# EAGLE design Arduino-Pro-Mini-v11 (EAGLE 6.0)
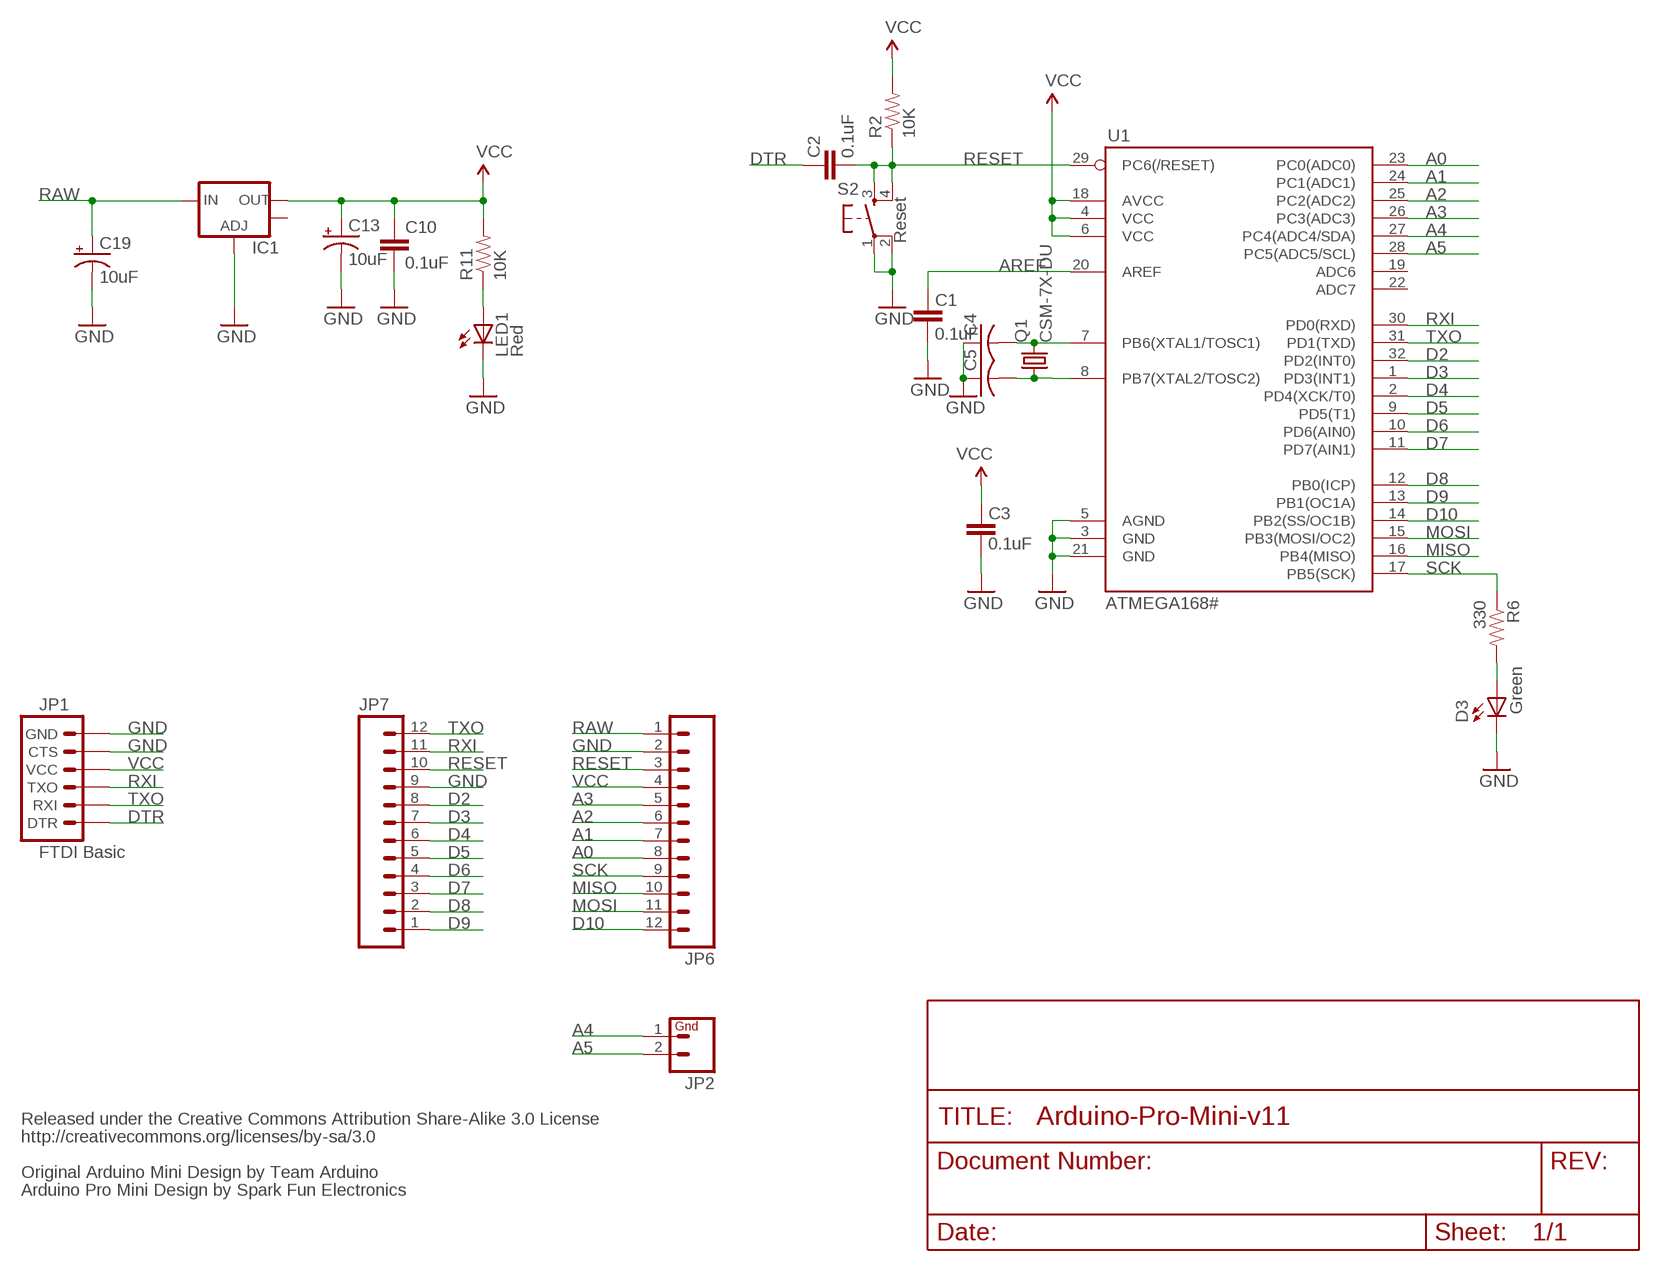
[diagram p0: schematic, sheet 1]

## Parts
C1  0.1uF  CAP0805  [0805]
C2  0.1uF  CAP0805  [0805]
C3  0.1uF  CAP0805  [0805]
C4  C-USC0805  [C0805]
C5  C-USC0805  [C0805]
C10  0.1uF  CAP0805  [0805]
C13  10uF  CAP_POL1206  [EIA3216]
C19  10uF  CAP_POL1206  [EIA3216]
D3  Green  LED0603  [LED-0603]
IC1  V_REG_LM1117SOT223  [SOT223]
JP1  FTDI Basic  ARDUINO_SERIAL_PROGRAMPTH  [1X06]
JP2  M02PTH  [1X02]
JP6  M12PTH  [1X12]
JP7  M12PTH  [1X12]
LED1  Red  LED0603  [LED-0603]
Q1  CSM-7X-DU  [CSM-7X-DU]
R2  10K  RESISTOR  [0805]
R6  330  RESISTOR  [0805]
R11  10K  RESISTOR  [0805]
S2  Reset  TAC_SWITCHSND  [TACTILE_SWITCH_SMD]
U1  ATMEGA168#  ATMEGA168  [TQFP32-08]

## Nets
A0: JP6.8 U1.23(PC0(ADC0))
A1: JP6.7 U1.24(PC1(ADC1))
A2: JP6.6 U1.25(PC2(ADC2))
A3: JP6.5 U1.26(PC3(ADC3))
A4: JP2.1 U1.27(PC4(ADC4/SDA))
A5: JP2.2 U1.28(PC5(ADC5/SCL))
AREF: C1.2 U1.20(AREF)
D2: JP7.8 U1.32(PD2(INT0))
D3: JP7.7 U1.1(PD3(INT1))
D4: JP7.6 U1.2(PD4(XCK/T0))
D5: JP7.5 U1.9(PD5(T1))
D6: JP7.4 U1.10(PD6(AIN0))
D7: JP7.3 U1.11(PD7(AIN1))
D8: JP7.2 U1.12(PB0(ICP))
D9: JP7.1 U1.13(PB1(OC1A))
D10: JP6.12 U1.14(PB2(SS/OC1B))
DTR: C2.2 JP1.1(DTR)
GND: C1.1 C3.1 C4.1 C5.1 C10.2 C13.C(-) C19.C(-) D3.C IC1.1(ADJ) JP1.5(CTS) JP1.6(GND) JP6.2 JP7.9 LED1.C S2.1 S2.2 U1.3(GND) U1.5(AGND) U1.21(GND)
MISO: JP6.10 U1.16(PB4(MISO))
MOSI: JP6.11 U1.15(PB3(MOSI/OC2))
N$1: C5.2 Q1.1 U1.8(PB7(XTAL2/TOSC2))
N$3: C4.2 Q1.2 U1.7(PB6(XTAL1/TOSC1))
N$7: D3.A R6.2
N$38: LED1.A R11.1
RAW [vcc]: C19.A(+) IC1.3(IN) JP6.1
RESET: C2.1 JP6.3 JP7.10 R2.1 S2.3 S2.4 U1.29(PC6(/RESET))
RXI: JP1.3(TXO) JP7.11 U1.30(PD0(RXD))
SCK: JP6.9 R6.1 U1.17(PB5(SCK))
TXO: JP1.2(RXI) JP7.12 U1.31(PD1(TXD))
VCC: C3.2 C10.1 C13.A(+) IC1.2(OUT) JP1.4(VCC) JP6.4 R2.2 R11.2 U1.4(VCC) U1.6(VCC) U1.18(AVCC)
Unconnected: IC1.4(OUT) U1.19(ADC6) U1.22(ADC7)

## Notes on the sheet
- Released under the Creative Commons Attribution Share-Alike 3.0 License
- http://creativecommons.org/licenses/by-sa/3.0
- Original Arduino Mini Design by Team Arduino
- Arduino Pro Mini Design by Spark Fun Electronics

## Library data of the parts
C1-C3 C10 = SparkFun:CAP: Capacitor Standard 0603 ceramic capacitor, and 0.1" leaded capacitor.
C4 C5 = rcl:C-US: CAPACITOR, American symbol
C13 C19 = SparkFun:CAP_POL: Capacitor Polarized These are standard SMD and PTH capacitors. Normally 10uF, 47uF, and 100uF in electrolytic and tantalum varieties. Always verify the external diameter of the through hole cap, it varies with capacity, voltage, and manufacturer. The EIA devices should be standard.
D3 LED1 = SparkFun:LED: LEDs Standard schematic elements and footprints for 5mm, 3mm, 1206, and 0603 sized LEDs. 5mm - Spark Fun Electronics SKU : COM-00529 (and others)
IC1 = SparkFun:V_REG_LM1117: Voltage Regulator LM1117 Standard adjustable voltage regulator but in SMD form. Spark Fun Electronics SKU : COM-00595
JP1 = SparkFun:ARDUINO_SERIAL_PROGRAM
JP2 = SparkFun:M02: Header 2 Standard 2-pin 0.1" header. Use with straight break away headers (SKU : PRT-00116), right angle break away headers (PRT-00553), swiss pins (PRT-00743), machine pins (PRT-00117), and female headers (PRT-00115). Molex polarized connector foot print use with SKU : PRT-08233 with associated crimp pins and housings.
JP6 JP7 = SparkFun:M12: Header 12 Standard 12-pin 0.1" header. Use with straight break away headers (SKU : PRT-00116), right angle break away headers (PRT-00553), swiss pins (PRT-00743), machine pins (PRT-00117), and female headers (PRT-00115).
Q1 = crystal:CSM-7X-DU: SMD CRYSTAL Source: www.ecsxtal.com .. Crystal 3.6864MHz CSM_7X_DU.PDF; OC_FARNELL: unknown; OC_NEWARK: unknown
R2 R6 R11 = SparkFun:RESISTOR: Resistor Basic schematic elements and footprints for 0603, 1206, and PTH 1/10th watt (small) resistors.
S2 = SparkFun:TAC_SWITCH: Momentary Switch Button commonly used for reset or general input. Spark Fun Electronics SKU : COM-00097
U1 = SparkFun:ATMEGA168

## Net classes
0 default: width 0.203 mm
1 vcc: width 0.254 mm

## Board
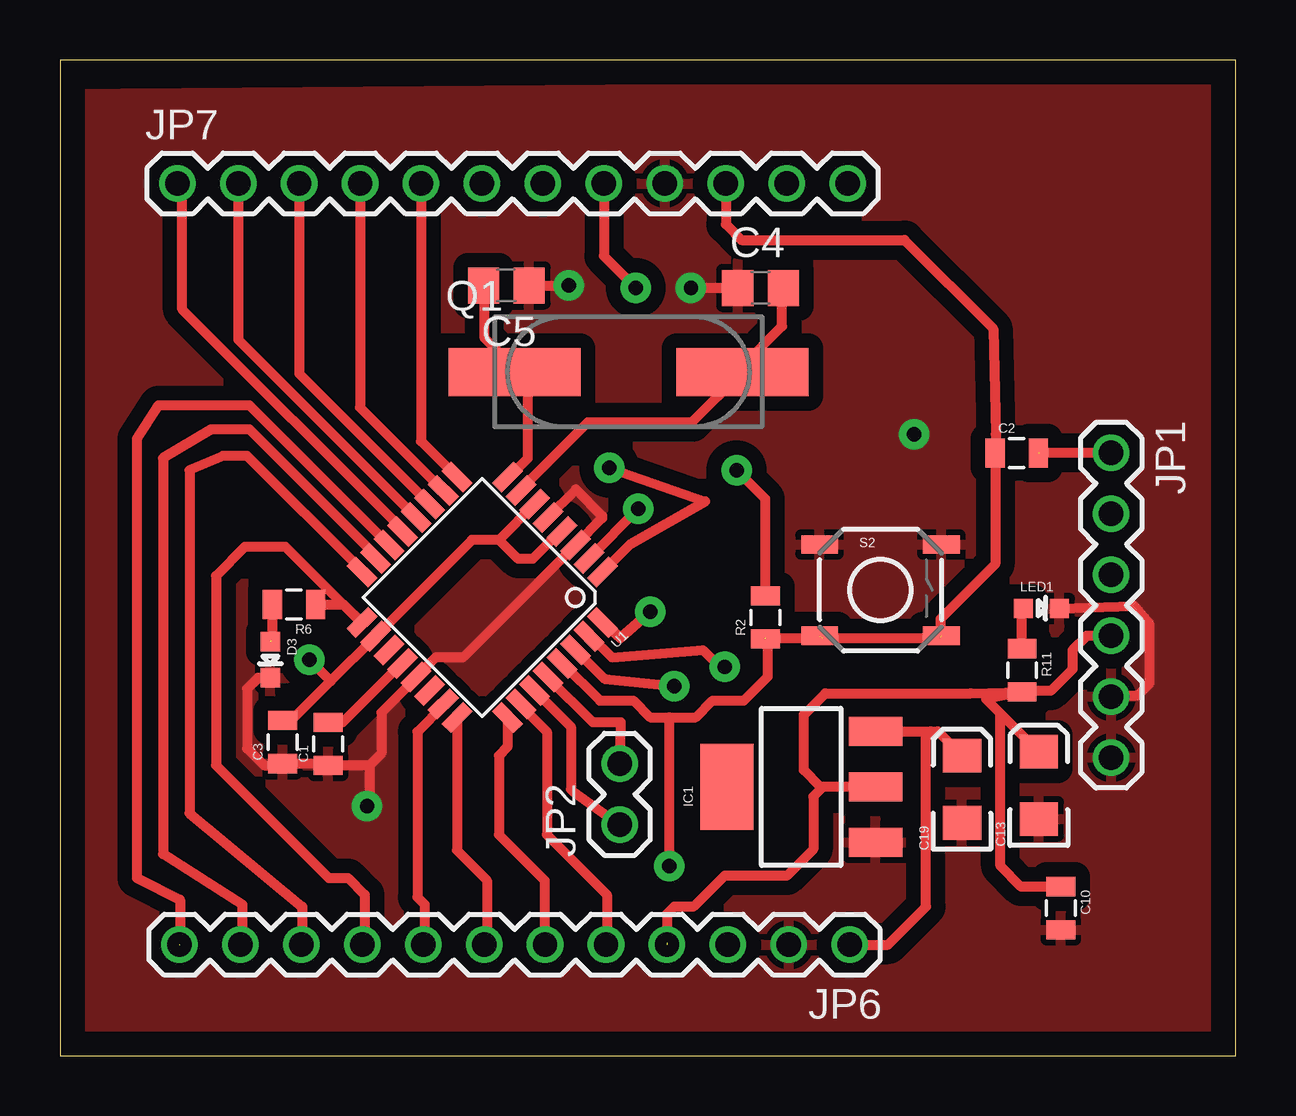
[diagram p1: board, top side]
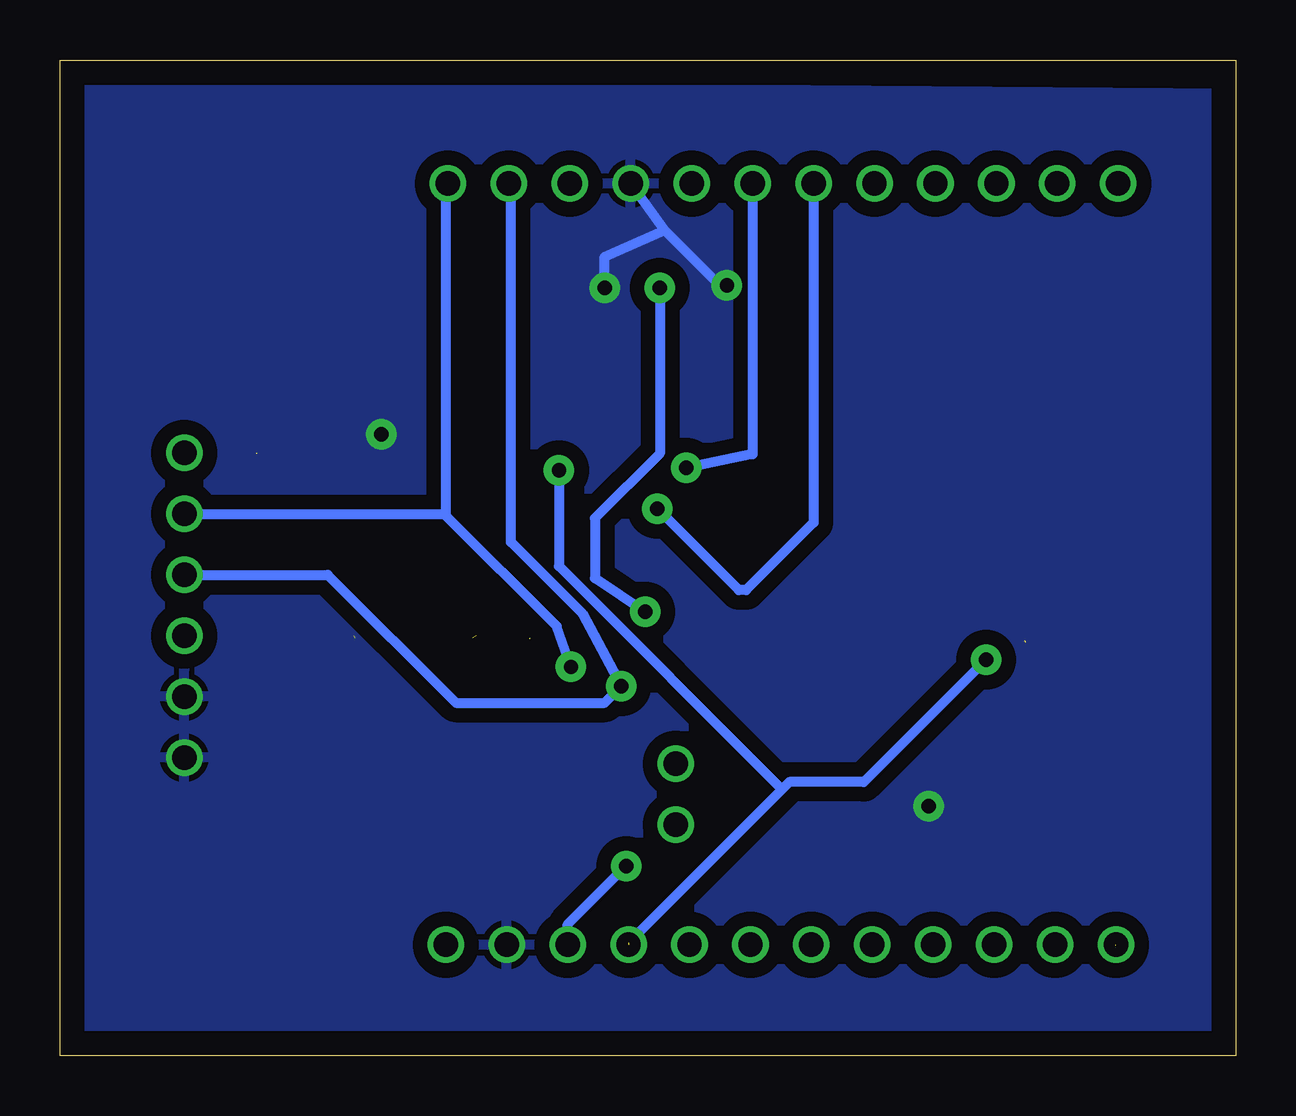
[diagram p2: board, bottom side, seen from below]

Size 49 x 41.5 mm. Coordinates in mm from the lower left corner, seen from the top.
Outline: 0,0 49,0 49,41.5 0,41.5 0,0
Copper layers (1*16): Top 0.035mm / dielectric 1.5mm / Bottom 0.035mm
Design rules: minimum track width 10mil, minimum drill 24mil, track to track 8mil, track to pad 8mil, pad to pad 8mil, via to via 8mil, smd to smd 8mil, copper to edge 40mil, drill to drill 8mil, minimum pad ring 10mil, minimum via ring 8mil, stop-mask expansion 4mil, vias tented up to drill 0mil, thermal gap 10mil

### Footprints (pad centres in the part's own frame; a part is rotated, then mirrored left to right if it is on the bottom)
0805 = smd 0.8 x 1.2: 1 -0.9,0; 2 0.9,0
C0805 = smd 1.3 x 1.5: 1 -0.95,0; 2 0.95,0
EIA3216 = smd 1.4 x 1.6: A 1.4,0; C -1.4,0
LED-0603 = smd 0.8 x 0.8: A 0,-0.75; C 0,0.75
SOT223 = smd 1.219 x 2.235: 1 -2.311,-3.099; 2 0,-3.099; 3 2.311,-3.099 | smd 3.6 x 2.2: 4 0,3.099
1X06 = drill 1.016: 1 0,0; 2 2.54,0; 3 5.08,0; 4 7.62,0; 5 10.16,0; 6 12.7,0
1X02 = drill 1.016: 1 0,0; 2 2.54,0
1X12 = drill 1.016: 1 0,0; 2 2.54,0; 3 5.08,0; 4 7.62,0; 5 10.16,0; 6 12.7,0; 7 15.24,0; 8 17.78,0; 9 20.32,0; 10 22.86,0; 11 25.4,0; 12 27.94,0
CSM-7X-DU = smd 5.5 x 2: 1 -4.75,0; 2 4.75,0
TACTILE_SWITCH_SMD = smd 1.524 x 0.762: 1 -2.54,1.905; 2 2.54,1.905; 3 -2.54,-1.905; 4 2.54,-1.905
TQFP32-08 = smd 1.27 x 0.559: 1 -4.293,2.8; 2 -4.293,2; 3 -4.293,1.2; 4 -4.293,0.4; 5 -4.293,-0.4; 6 -4.293,-1.2; 7 -4.293,-2; 8 -4.293,-2.8; 17 4.293,-2.8; 18 4.293,-2; 19 4.293,-1.2; 20 4.293,-0.4; 21 4.293,0.4; 22 4.293,1.2; 23 4.293,2; 24 4.293,2.8 | smd 0.559 x 1.27: 9 -2.8,-4.293; 10 -2,-4.293; 11 -1.2,-4.293; 12 -0.4,-4.293; 13 0.4,-4.293; 14 1.2,-4.293; 15 2,-4.293; 16 2.8,-4.293; 25 2.8,4.293; 26 2,4.293; 27 1.2,4.293; 28 0.4,4.293; 29 -0.4,4.293; 30 -1.2,4.293; 31 -2,4.293; 32 -2.8,4.293

### Placement (x,y rotation side)
C1  11.18,12.99 90 top
C2  39.88,25.12 0 top
C3  9.28,13.07 90 top
C4  29.2,32 0 top
C5  18.6,32.1 180 top
C10  41.72,6.14 270 top
C13  40.8,11.26 90 top
C19  37.6,11.1 90 top
D3  8.77,16.5 180 top
IC1  30.9,11.2 90 top
JP1  43.82,25.12 270 top
JP2  23.33,9.62 90 top
JP6  32.92,4.62 180 top
JP7  4.89,36.35 0 top
LED1  40.91,18.64 270 top
Q1  23.7,28.5 0 top
R2  29.4,18.26 90 top
R6  9.75,18.8 180 top
R11  40.1,16.06 270 top
S2  34.2,19.4 0 top
U1  17.6,19.1 225 top

### Tracks (layer width: path | path; a pad name or v marks a point on that pad's centre or on a via)
A0
  Top 0.406: U1.23 15.98,14.58 14.9,13.5 14.9,6.6 15.2,6.3 15.2,4.68 JP6.8
A1
  Top 0.406: U1.24 16.55,8.55 17.8,7.3 17.8,4.74 JP6.7
A2
  Top 0.406: U1.25 18.66,12.86 18.3,12.5 18.3,9.2 20.2,7.3 20.2,4.64 JP6.6
A3
  Top 0.406: U1.26 19.22,14.58 20.3,13.5 20.3,9.2 22.8,6.7 22.8,4.66 JP6.5
A4
  Top 0.406: U1.27 19.83,15.22 19.83,15.17 21.3,13.7 21.3,11.1 21.4,11 JP2.1
A5
  Top 0.406: U1.28 20.35,15.75 22.2,13.9 23.37,13.9 JP2.2
AREF
  Top 0.406: U1.20 14.25,16.35 11.8,13.9 C1.2
D2  (via drill 0.6 pad 1.27)
  Top 0.406: JP7.8 22.67,33.33 v24,32 | v24.6,18.5 23.36,17.4 U1.32
  Bottom 0.406: v24,32 24,25.1 26.7,22.4 26.7,19.9 v24.6,18.5
D3  (via drill 0.6 pad 1.27)
  Top 0.406: v22.9,24.5 26.9,23.1 23.76,21.3 U1.1
  Bottom 0.406: JP7.7 20.13,25.07 v22.9,24.5
D4  (via drill 0.6 pad 1.27)
  Top 0.406: v24.1,22.8 24.1,22.77 U1.2
  Bottom 0.406: JP7.6 17.59,22.21 20.4,19.4 20.7,19.4 v24.1,22.8
D5
  Top 0.406: JP7.5 15.05,25.61 U1.9
D6
  Top 0.406: JP7.4 12.51,27.02 U1.10
D7
  Top 0.406: JP7.3 9.97,28.43 U1.11
D8
  Top 0.406: JP7.2 7.43,29.84 U1.12
D9
  Top 0.406: U1.13 14.28,21.92 5.1,31.1 5.1,36.14 JP7.1
D10  (1 unrouted)
  Top 0.406: U1.14 7.9,27.1 4.1,27.1 3.2,25.7 3.2,7.4 5,6.5 5,4.7 5,4.6
DTR  (1 unrouted)
  Top 0.406: JP1.1 40.82,25.12 40.8,25.1
GND  (via drill 0.6 pad 1.27)
  Top 0.406: 12.9,12.1 13.4,12.6 13.4,14.3 14.85,15.75 U1.21 15.67,16.6 16.8,16.6 U1.3 22.6,22.4 22.6,22.5 21.5,23.6 20.35,22.45 U1.5 | 12.9,12.1 C1.1 11.1,12.17 C3.1 9.21,12.1 8.5,12.1 7.8,12.8 7.8,15.3 8.25,15.75 D3.C | C5.1 v21.2,32.1 | C4.1 v26.3,32 | 12.9,12.1 12.9,10.5 v12.8,10.4 | LED1.C 44.76,18.74 45.4,18 45.4,15.5 44.9,15 43.86,15 JP1.5
  Bottom 0.406: v21.2,32.1 21.5,32.1 23.8,34.4 | 23.8,34.4 JP7.9 | v26.3,32 26.3,33.3 23.8,34.4
  other vias: 35.6,25.9
  pour Top (isolate 0.61): 0,40.1 48,40.5 47.8,0.2 0,0
  pour Bottom (isolate 0.61): 0.1,40.1 47.9,40.5 47.8,0.1 0,0
MISO
  Top 0.406: U1.16 12.59,20.21 7.8,25 6.8,25 5.4,24.4 5.4,10.1 10.1,6.2 10.1,4.66 JP6.10
MOSI
  Top 0.406: U1.15 13.15,20.85 7.9,26.1 6.3,26.1 4.3,24.9 4.3,8.4 7.6,6.3 7.6,4.7 JP6.11
N$1
  Top 0.406: U1.8 18.71,24.11 19.5,24.9 19.5,27.95 Q1.1 18.95,28.65 17.7,29.9 17.7,32.05 C5.2
N$3
  Top 0.406: U1.7 19.22,23.62 22,26.4 26.35,26.4 Q1.2 28.45,28.75 30.1,30.4 30.1,31.95 C4.2
N$7  (1 unrouted)
  Top 0.406: R6.2 8.85,17.35 8.8,17.3
N$38
  Top 0.406: R11.1 40.1,18.8 LED1.A
RAW
  Top 0.406: IC1.3 36.3,13.51 | 36.3,13.51 36.59,13.51 C19.A | JP6.1 34.52,4.62 36.1,6.2 36.1,13.31 36.3,13.51
RESET  (via drill 0.6 pad 1.27)  (3 unrouted)
  Top 0.406: U1.29 20.95,16.35 22.5,14.8 23.9,14.8 24.6,14.1 25.4,14.1 | 25.4,14.1 26.5,14.1 27.2,14.8 28.5,14.8 29.5,15.8 29.5,17.3 29.4,17.4 31.8,17.4 36.7,17.4 36.9,17.6 | v25.4,7.9 25.4,14.1 | JP7.10 27.75,34.65 28.4,34 35.2,34 38.9,30.3 39,25.9 C2.1 38.98,20.48 36.7,18.2 36.7,17.54 S2.4
  Bottom 0.406: JP6.3 27.84,5.46 v25.4,7.9
RXI  (via drill 0.6 pad 1.27)
  Top 0.406: U1.30 22.7,15.7 v25.6,15.4
  Bottom 0.406: JP7.11 30.2,36.26 30.2,21.4 27.2,18.4 v25.6,15.4 26.3,14.7 32.5,14.7 37.84,20.04 JP1.3
SCK
  Top 0.406: R6.1 11.83,18.8 U1.17 12.55,18.05 9.4,21.2 7.7,21.2 6.5,20 6.5,12.1 11.2,7.4 12,7.4 12.7,6.7 12.7,4.72 JP6.9
TXO  (via drill 0.6 pad 1.27)
  Top 0.406: U1.31 22.12,17.48 23,16.6 26.8,16.9 27.5,16.2 v27.7,16.2
  Bottom 0.406: v27.7,16.2 28.3,17.9 32.9,22.5 | 32.9,22.5 32.9,36.28 JP7.12 | JP1.2 32.98,22.58 32.9,22.5
VCC  (via drill 0.6 pad 1.27)  (2 unrouted)
  Top 0.406: C3.2 9.64,13.97 11.29,15.61 | 11.29,15.61 U1.18 17.17,21.5 18.3,21.5 | U1.6 18.3,21.5 | U1.4 20.85,21.85 19.7,20.7 19.1,20.7 18.3,21.5 | 10.5,16.4 v10.4,16.5 11.29,15.61 | R2.2 29.4,23.2 v28.2,24.4 | 25.3,4.7 25.3,5.9 25.6,6.2 26.4,6.2 27.7,7.5 30.3,7.5 31.4,8.6 31.4,10.8 31.8,11.2 IC1.2 31.7,11.2 31,11.9 31,14.2 31.9,15.1 37.96,15.1 R11.2 | R11.2 38.6,14.86 39.18,14.28 | 39.18,14.28 C13.A | C10.1 40.06,7.04 39.2,7.9 39.2,14.26 39.18,14.28 | JP1.4 42.8,17.5 42.2,16.9 42.2,16.1 41.3,15.2 40.14,15.2 R11.2
  Bottom 0.406: v10.4,16.5 15.5,11.4 18.6,11.4 18.9,11.1 | 18.9,11.1 25.3,4.7 | v28.2,24.4 28.2,20.4 18.9,11.1